# EAGLE design test_shield (EAGLE 9.1.3)
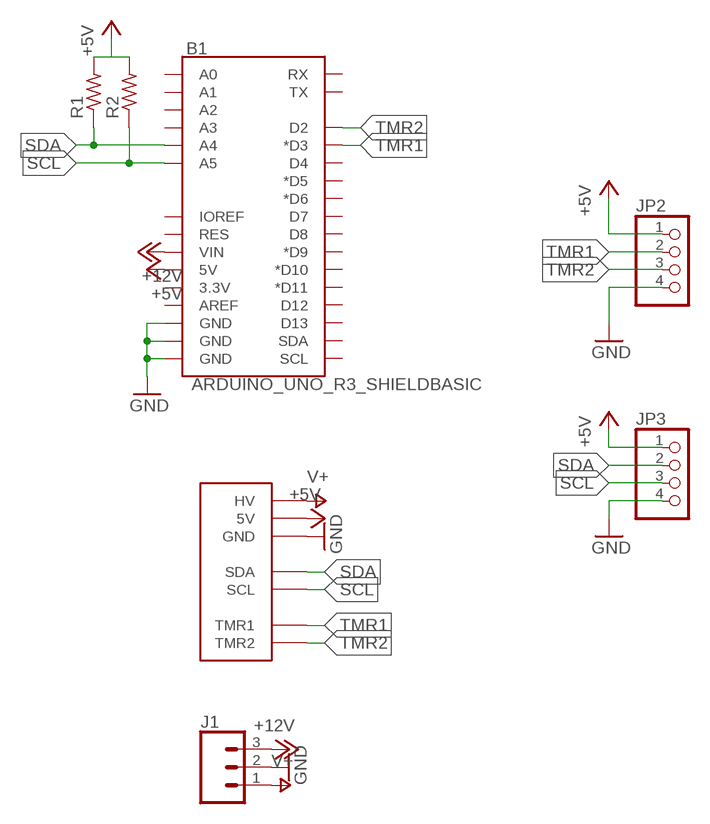
[diagram p0: schematic, sheet 1]

## Parts
B1  ARDUINO_UNO_R3_SHIELDBASIC  [UNO_R3_SHIELD]
J1  CONN_03-SCREW-5MM  [SCREWTERMINAL-5MM-3]
JP1  PCIE_RA  [PCIE_RA]
JP2  PINHD-1X4  [1X04]
JP3  PINHD-1X4  [1X04]
R1  R-US_0207/10  [0207/10]
R2  R-US_0207/10  [0207/10]

## Nets
+5V: B1.5V JP1.A12(5V) JP1.A13(5V) JP1.A14(5V) JP1.B12(5V) JP1.B13(5V) JP1.B14(5V) JP2.1 JP3.1 R1.2 R2.2
+12V: B1.VIN J1.3
GND: B1.GND@0(GND) B1.GND@1(GND) B1.GND@2(GND) J1.2 JP1.A1(GND) JP1.A2(GND) JP1.A3(GND) JP1.B1(GND) JP1.B2(GND) JP1.B3(GND) JP2.4 JP3.4
SCL: B1.A5 JP1.A5(SCL) JP1.B5(SCL) JP3.3 R2.1
SDA: B1.A4 JP1.A6(SDA) JP1.B6(SDA) JP3.2 R1.1
TMR1: B1.D3(*D3) JP1.A8(TMR1) JP1.B8(TMR1) JP2.2
TMR2: B1.D2 JP1.A9(TMR2) JP1.B9(TMR2) JP2.3
V+: J1.1 JP1.A16(HV) JP1.A17(HV) JP1.A18(HV) JP1.B16(HV) JP1.B17(HV) JP1.B18(HV)
Unconnected: B1.3.3V B1.A0 B1.A1 B1.A2 B1.A3 B1.AREF B1.D4 B1.D5(*D5) B1.D6(*D6) B1.D7 B1.D8 B1.D9(*D9) B1.D10(*D10) B1.D11(*D11) B1.D12 B1.D13 B1.IOREF B1.RES B1.RX B1.SCL B1.SDA B1.TX

## Library data of the parts
B1 = SparkFun-Boards:ARDUINO_UNO_R3_SHIELD: Arduino R3 Shield Footprint Shield form compatible with the Arduino Uno R3. SparkFun Products: MG2639 Cellular Shield <https://www.sparkfun.com/products/13120> MIDI Shield <https://www.sparkfun.com/products/12898> R3 Stackable Headers Kit <https://www.sparkfun.com/products/11417>
J1 = SparkFun-Connectors:CONN_03: Multi connection point. Often used as Generic Header-pin footprint for 0.1 inch spaced/style header connections On any of the 0.1 inch spaced packages, you can populate with these: Break Away Headers - Straight <https://www.sparkfun.com/products/116> (PRT-00116) Break Away Male Headers - Right Angle <https://www.sparkfun.com/products/553> (PRT-00553) Female Headers <https://www.sparkfun.com/products/115> (PRT-00115) Break Away Headers - Machine Pin <https://www.sparkfun.com/products/117> (PRT-00117) Break Away Female Headers - Swiss Machine Pin <https://www.sparkfun.com/products/743> (PRT-00743) Stackable Header - 3 Pin (Female, 0.1") <https://www.sparkfun.com/products/13875> (PRT-13875) For SCREWTERMINALS and SPRING TERMINALS visit here: Screw Terimnals on SparkFun.com <https://www.sparkfun.com/search/results?term=Screw+Terminals> (5mm/3.5mm/2.54mm spacing) This device is also useful as a general connection point to wire up your design to another part of your project. Our various solder wires solder well into these plated through hole pads. Hook-Up Wire - Assortment (Stranded, 22 AWG) <https://www.sparkfun.com/products/11375> (PRT-11375) Hook-Up Wire - Assortment (Solid Core, 22 AWG) <https://www.sparkfun.com/products/11367> (PRT-11367) View the entire wire category on our website here <https://www.sparkfun.com/categories/141> Special notes: Molex polarized connector foot print use with SKU : PRT-08232 with associated crimp pins and housings.; PROD_ID: CONN-10134; SF_SKU: PRT-08433
JP1 = tide_clock:PCIE_RA
JP2 JP3 = pinhead:PINHD-1X4: PIN HEADER
R1 R2 = resistor:R-US_: RESISTOR, American symbol

## Board
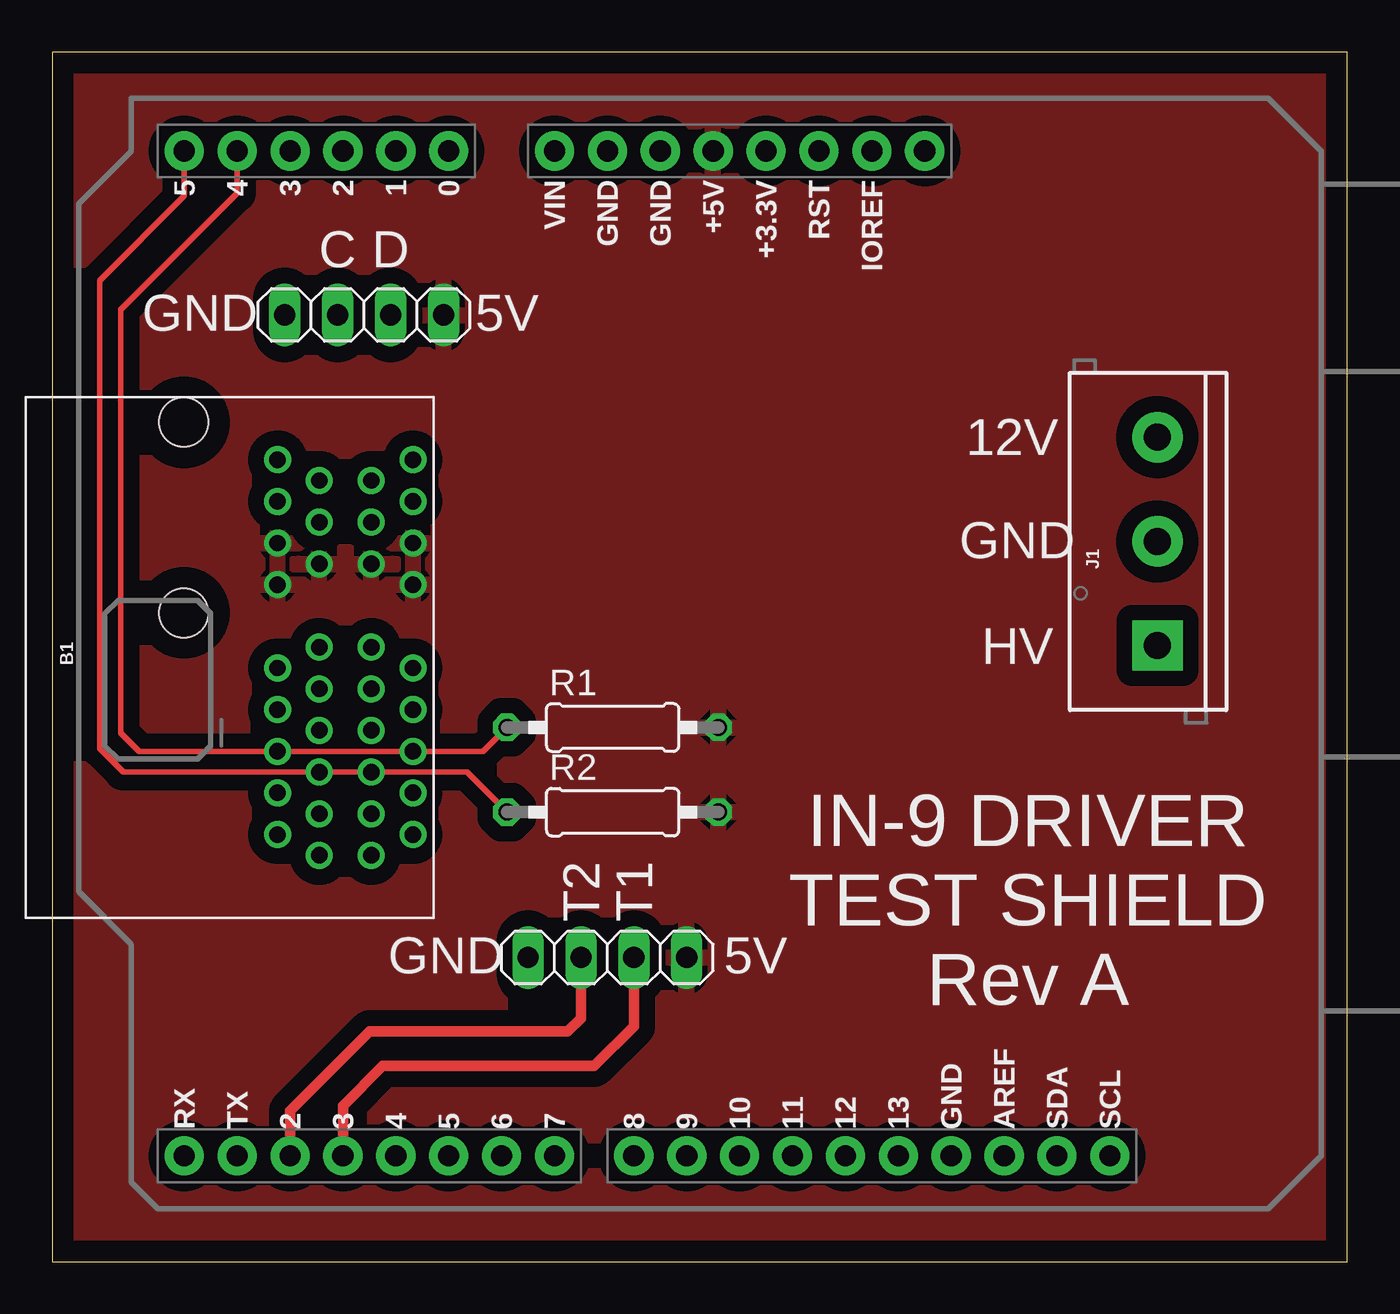
[diagram p1: board, top side]
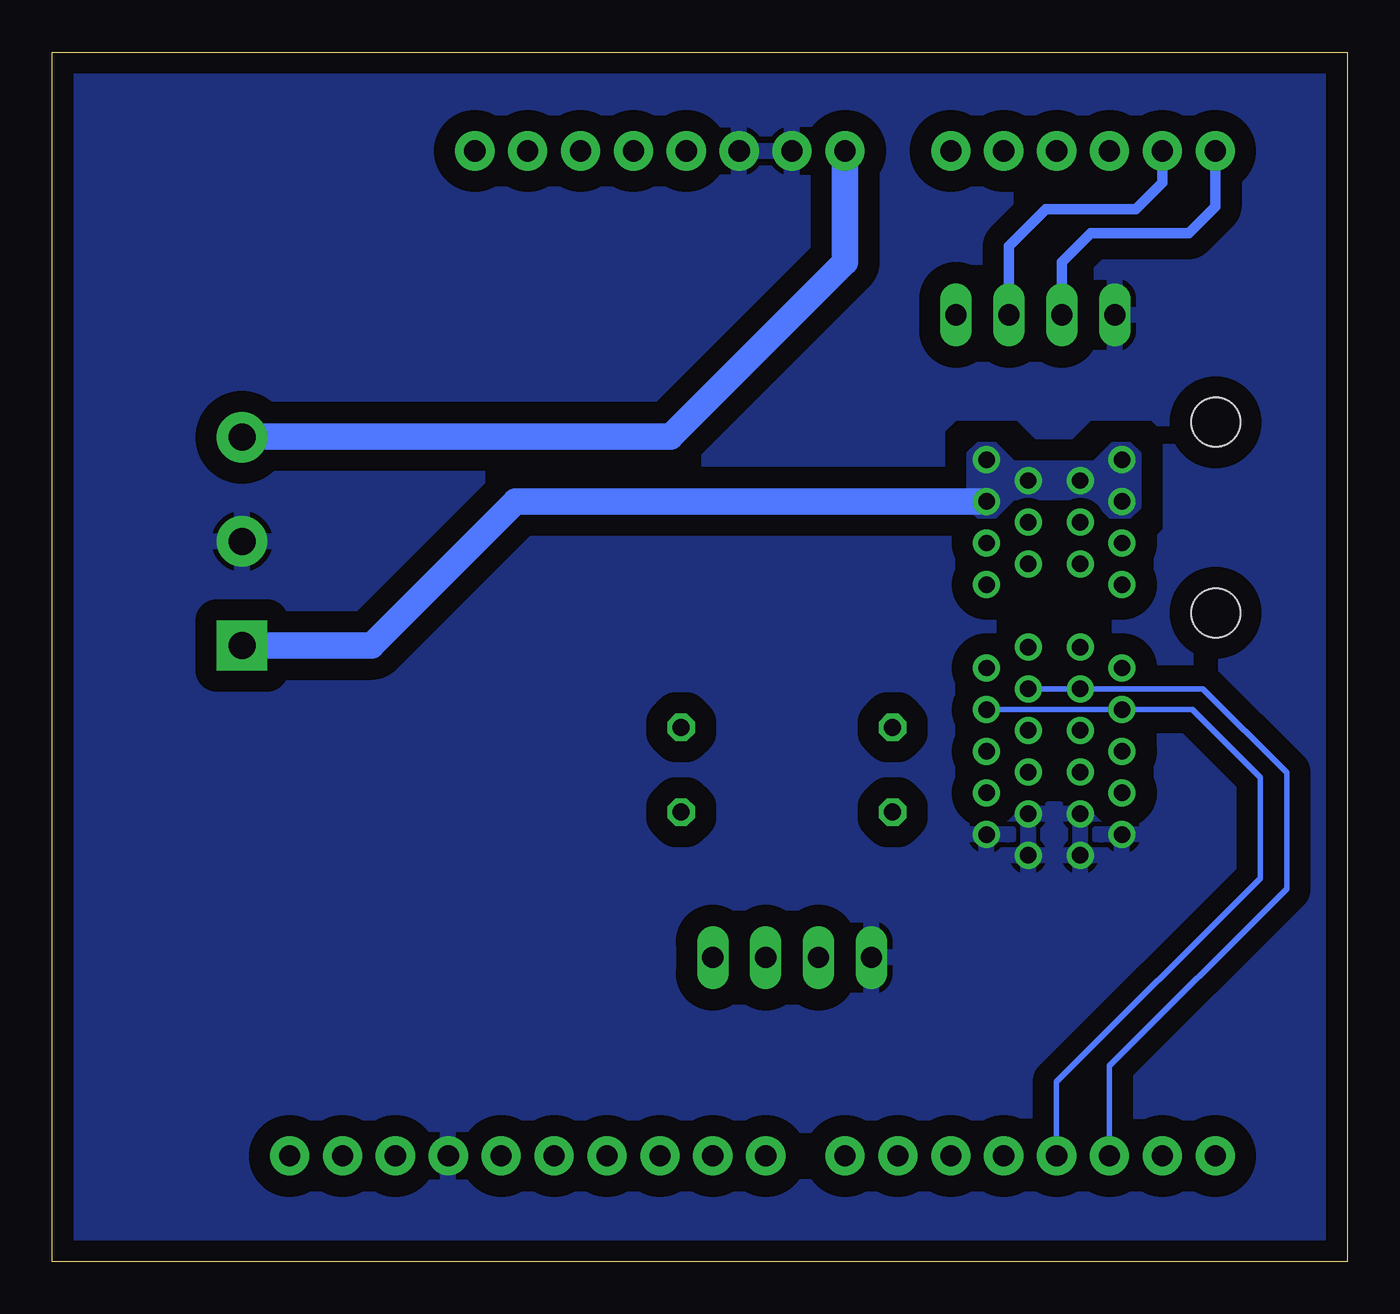
[diagram p2: board, bottom side, seen from below]

Size 62.21 x 58.09 mm. Coordinates in mm from the lower left corner, seen from the top.
Outline: 0,0 62.21,0 62.21,58.09 0,58.09 0,0
Copper layers (1*16): Top 0.035mm / dielectric 1.5mm / Bottom 0.035mm
Design rules "default": minimum track width 6mil, minimum drill 0.35mm, track to track 6mil, track to pad 6mil, pad to pad 6mil, via to via 6mil, smd to smd 6mil, copper to edge 40mil, drill to drill 6mil, minimum pad ring 10mil, minimum via ring 8mil, stop-mask expansion 4mil, vias tented up to drill 0mil, thermal gap 10mil

### Footprints (pad centres in the part's own frame; a part is rotated, then mirrored left to right if it is on the bottom)
UNO_R3_SHIELD = drill 1.016 pad 1.88: 3.3V 24.13,-2.54; 5V 24.13,0; A0 24.13,12.7; A1 24.13,15.24; A2 24.13,17.78; A3 24.13,20.32; A4 24.13,22.86; A5 24.13,25.4; AREF -24.13,-13.97; D2 -24.13,20.32; D3 -24.13,17.78; D4 -24.13,15.24; D5 -24.13,12.7; D6 -24.13,10.16; D7 -24.13,7.62; D8 -24.13,3.81; D9 -24.13,1.27; D10 -24.13,-1.27; D11 -24.13,-3.81; D12 -24.13,-6.35; D13 -24.13,-8.89; GND@0 24.13,2.54; GND@1 24.13,5.08; GND@2 -24.13,-11.43; IOREF 24.13,-7.62; NC 24.13,-10.16; RES 24.13,-5.08; RX -24.13,25.4; SCL -24.13,-19.05; SDA -24.13,-16.51; TX -24.13,22.86; VIN 24.13,7.62
SCREWTERMINAL-5MM-3 = drill 1.3 pad 2.413 square: 1 0,0 | drill 1.3 pad 2.413: 2 5,0; 3 10,0
PCIE_RA = drill 0.79: A1 -3,14.1; A2 -4,12.1; A3 -5,14.1; A4 -6,12.1; A5 -7,14.1; A6 -8,12.1; A7 -9,14.1; A8 -10,12.1; A9 -11,14.1; A10 -12,12.1; A11 -13,14.1; A12 -16,12.1; A13 -17,14.1; A14 -18,12.1; A15 -19,14.1; A16 -20,12.1; A17 -21,14.1; A18 -22,12.1; B1 -3,16.6; B2 -4,18.6; B3 -5,16.6; B4 -6,18.6; B5 -7,16.6; B6 -8,18.6; B7 -9,16.6; B8 -10,18.6; B9 -11,16.6; B10 -12,18.6; B11 -13,16.6; B12 -16,18.6; B13 -17,16.6; B14 -18,18.6; B15 -19,16.6; B16 -20,18.6; B17 -21,16.6; B18 -22,18.6 | hole 2.35: -14.65,7.6; -23.8,7.6
1X04 = drill 1.016 long: 1 -3.81,0; 2 -1.27,0; 3 1.27,0; 4 3.81,0
0207/10 = drill 0.813 octagon: 1 -5.08,0; 2 5.08,0

### Placement (x,y rotation side)
B1  31.75,29.21 90 top
J1  53.09,29.59 90 top
JP1  -1.27,16.51 270 top
JP2  26.67,14.61 180 top
JP3  14.99,45.47 180 top
R1  26.92,25.65 0 top
R2  26.92,21.59 0 top

### Tracks (layer width: path | path; a pad name or v marks a point on that pad's centre or on a via)
+5V
  pour Top (isolate 0.762): 0,58.17 62.23,58.17 62.23,0 0,0
+12V
  Bottom 1.27: B1.VIN 24.13,48.01 32.51,39.62 53.09,39.62 J1.3
GND
  pour Bottom (isolate 1.016, rank 2): 0,57.91 62.23,57.91 62.23,-0.25 0,-0.25
SCL
  Top 0.254: R2.1 19.92,23.51 JP1.B5 JP1.A5 3.41,23.51 2.29,24.64 2.29,47.12 6.35,51.18 B1.A5
  Bottom 0.508: B1.A5 6.35,50.67 7.62,49.4 12.32,49.4 13.72,48.01 JP3.3
SDA
  Top 0.254: B1.A4 8.89,51.31 3.3,45.72 3.3,25.4 4.19,24.51 JP1.A6 JP1.B6 20.7,24.51 R1.1
  Bottom 0.508: B1.A4 8.89,51.82 10.16,50.55 14.48,50.55 16.26,48.77 JP3.2
TMR1
  Top 0.508: B1.D3 13.97,7.49 15.88,9.4 26.04,9.4 27.94,11.3 JP2.2
  Bottom 0.254: JP1.B8 JP1.A8 7.46,26.51 4.19,23.24 4.19,18.41 13.97,8.64 B1.D3
TMR2
  Top 0.508: B1.D2 11.43,7.24 15.24,11.05 24.77,11.05 25.4,11.68 JP2.3
  Bottom 0.254: JP1.B9 JP1.A9 6.94,27.51 2.92,23.5 2.92,17.91 11.43,9.4 B1.D2
V+
  Bottom 1.27: JP1.B16 39.94,36.51 46.86,29.59 J1.1
  pour Bottom (isolate 0.508, no thermals): 10.41,35.69 9.91,36.2 9.91,38.86 10.41,39.37 11.3,39.37 12.19,38.48 13.46,38.48 16,38.48 16.89,39.37 17.78,39.37 18.29,38.86 18.29,36.2 17.78,35.69 16.89,35.69 16,36.58 12.32,36.58 11.43,35.69

### Text on the board
tPlace: C | D | GND | 5V | 12V | GND | HV | T2 | T1 | IN-9 DRIVER / TEST SHIELD / Rev A | GND | 5V